# Altium project IMX8SoCIot.PrjPcb (part 4 of 4)

## Sheet Interconnect.SchDoc
size 594 x 420 mm; SheetNumber: 12; SheetTotal: 12
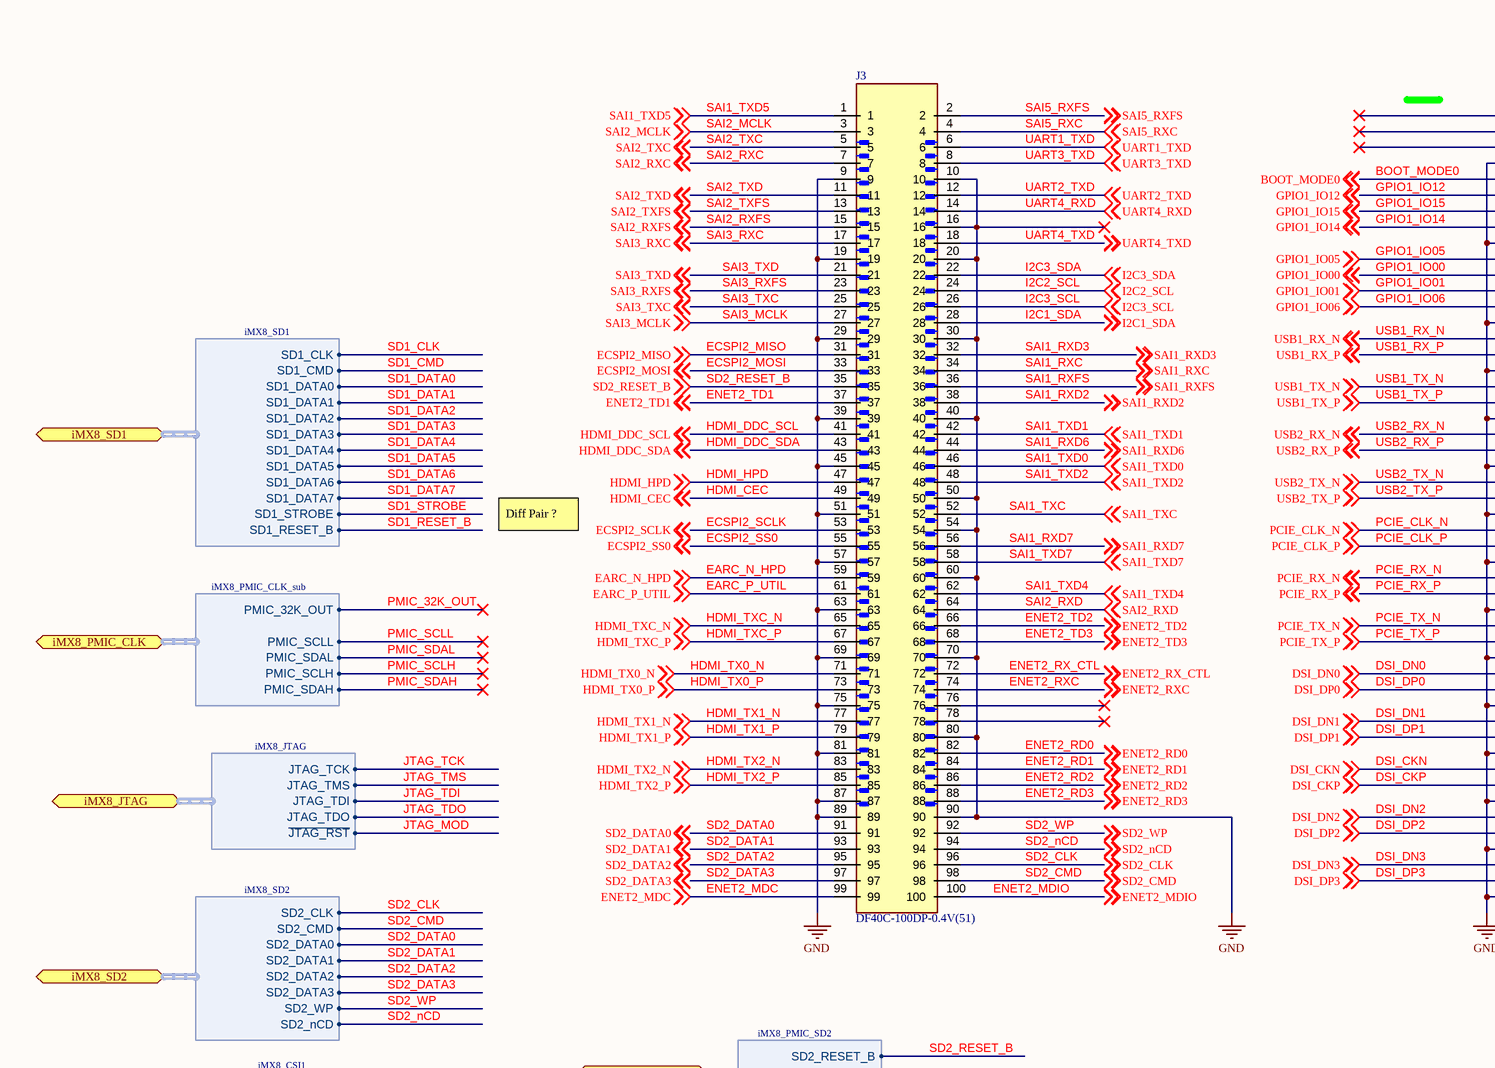
[diagram p21: Interconnect.SchDoc, top left]
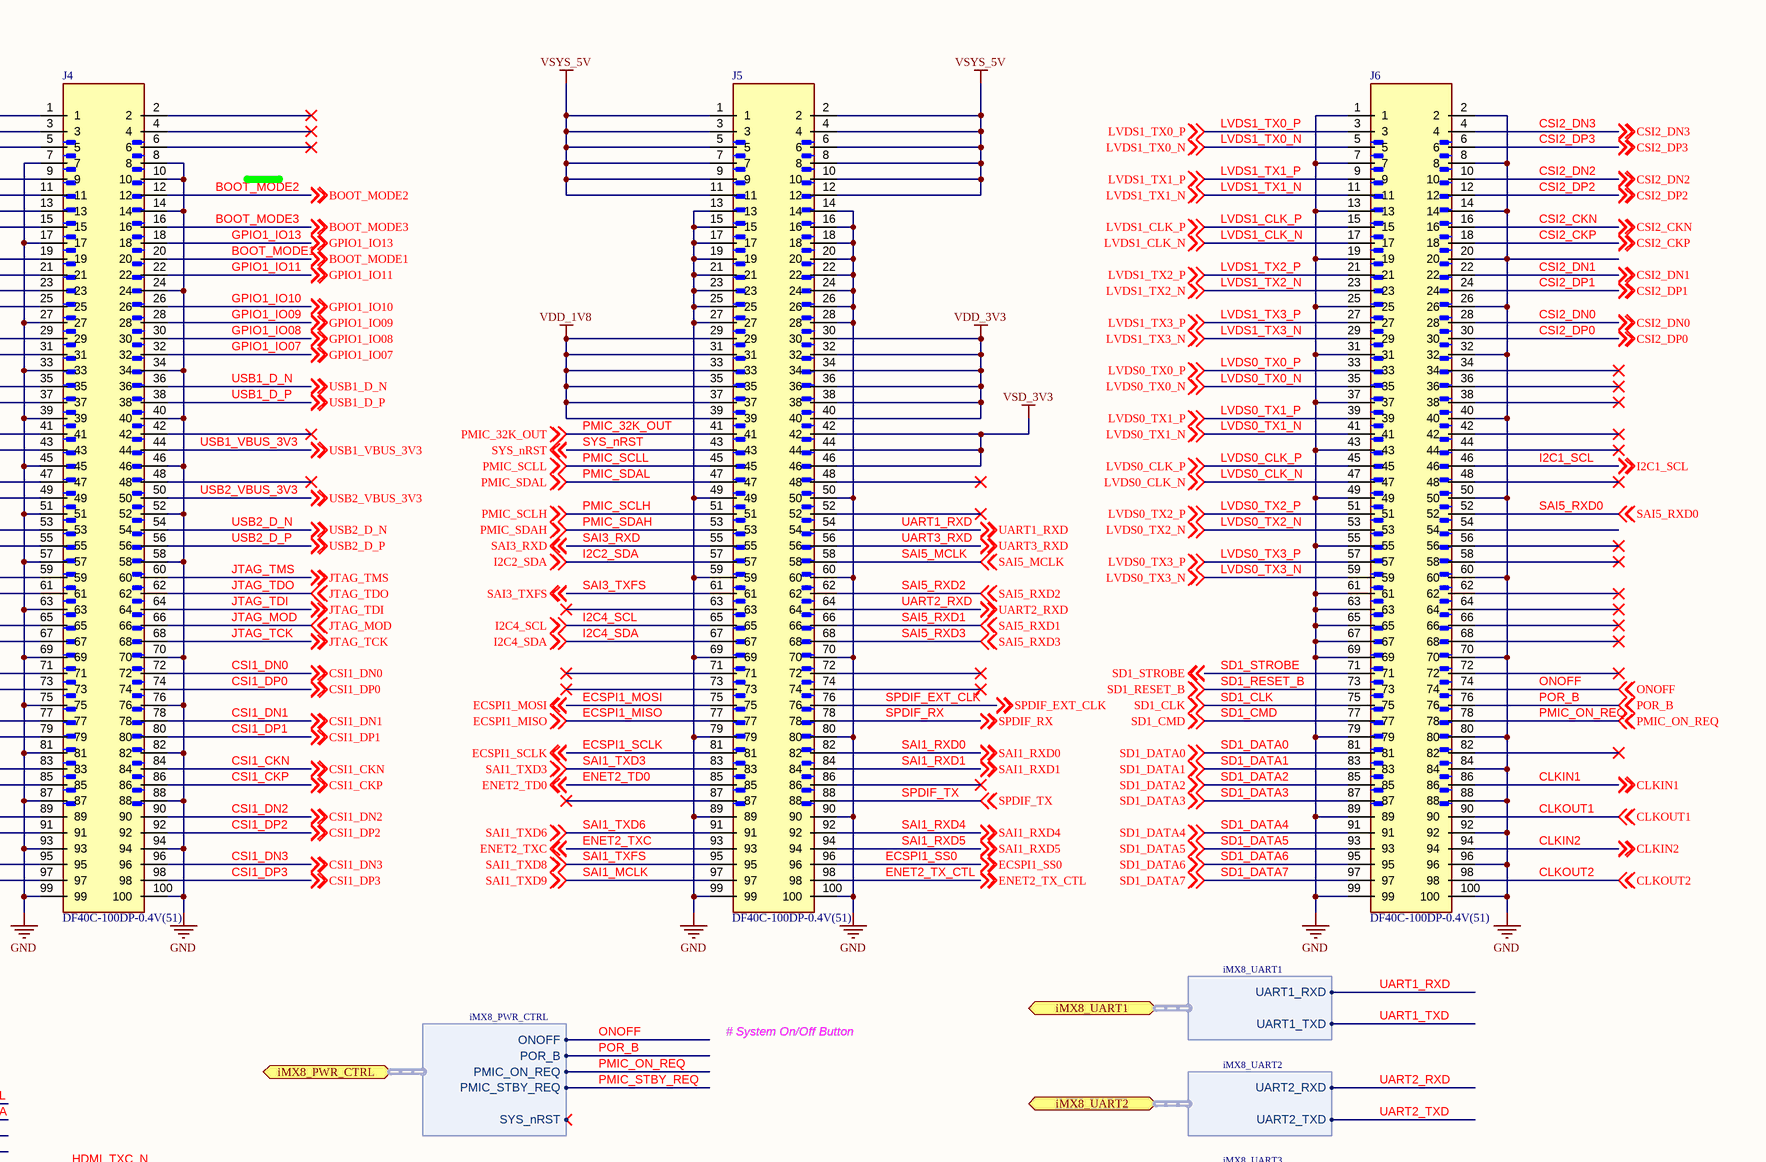
[diagram p22: Interconnect.SchDoc, top right]
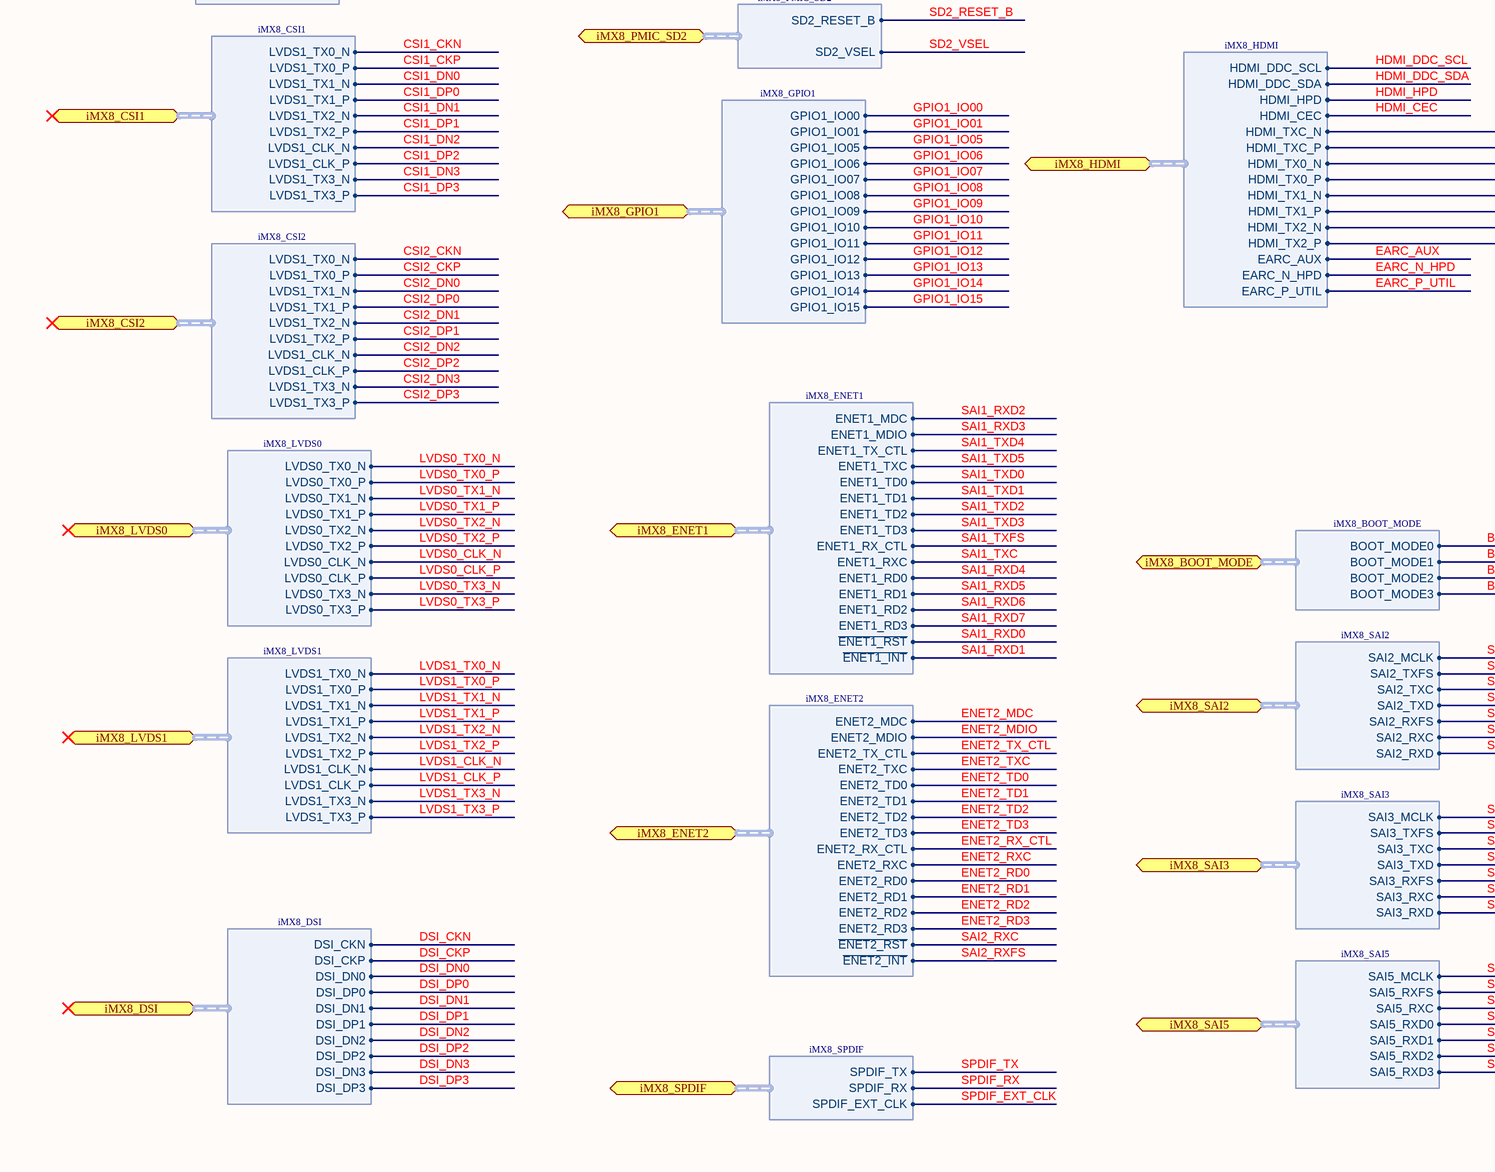
[diagram p23: Interconnect.SchDoc, bottom left]
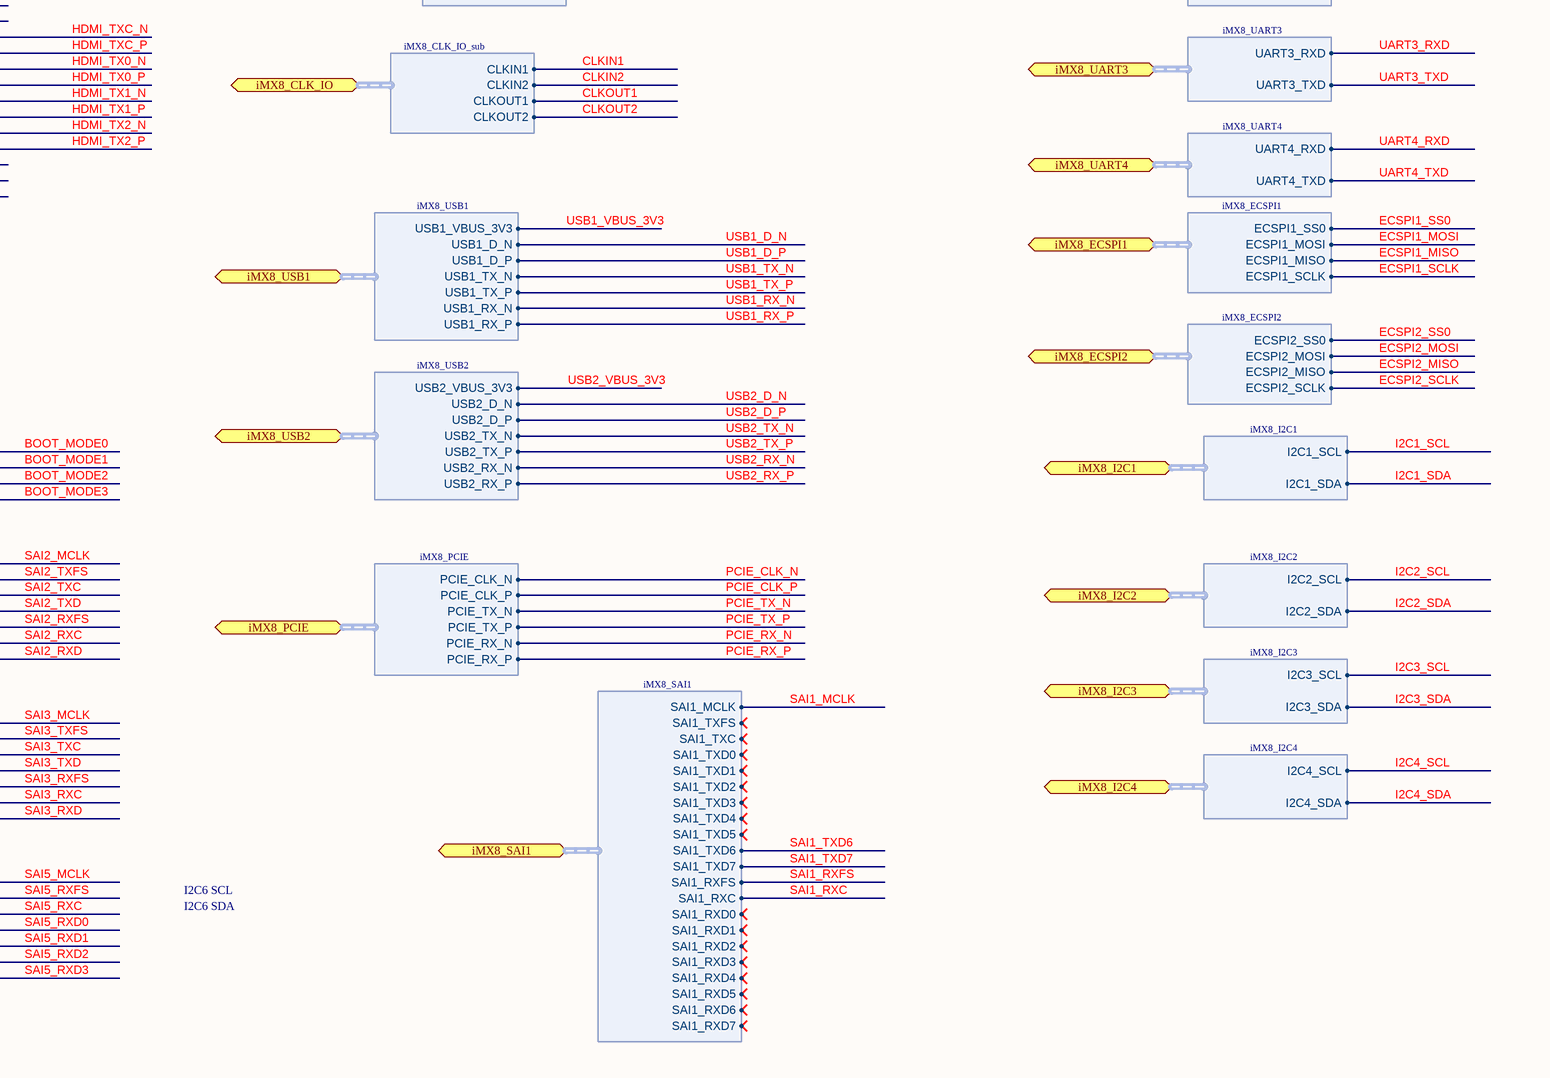
[diagram p24: Interconnect.SchDoc, bottom right]

### Parts
J3  DF40C-100DP-0.4V(51)  [HIROSE_DF40C-100DP-0.4V(51)]
J4  DF40C-100DP-0.4V(51)  [HIROSE_DF40C-100DP-0.4V(51)]
J5  DF40C-100DP-0.4V(51)  [HIROSE_DF40C-100DP-0.4V(51)]
J6  DF40C-100DP-0.4V(51)  [HIROSE_DF40C-100DP-0.4V(51)]

### Ports
iMX8_BOOT_MODE (bidir, harness iMX8_BOOT_MODE), iMX8_CLK_IO (bidir, harness iMX8_CLK_IO_sub), iMX8_CSI1 (bidir, harness iMX8_CSI1), iMX8_CSI2 (bidir, harness iMX8_CSI2), iMX8_DSI (bidir, harness iMX8_DSI), iMX8_ECSPI1 (bidir, harness iMX8_ECSPI1), iMX8_ECSPI2 (bidir, harness iMX8_ECSPI2), iMX8_ENET1 (bidir, harness iMX8_ENET1), iMX8_ENET2 (bidir, harness iMX8_ENET2), iMX8_GPIO1 (bidir, harness iMX8_GPIO1), iMX8_HDMI (bidir, harness iMX8_HDMI), iMX8_I2C1 (bidir, harness iMX8_I2C1), iMX8_I2C2 (bidir, harness iMX8_I2C2), iMX8_I2C3 (bidir, harness iMX8_I2C3), iMX8_I2C4 (bidir, harness iMX8_I2C4), iMX8_JTAG (bidir, harness iMX8_JTAG), iMX8_LVDS0 (bidir, harness iMX8_LVDS0), iMX8_LVDS1 (bidir, harness iMX8_LVDS1), iMX8_PCIE (bidir, harness iMX8_PCIE), iMX8_PMIC_CLK (bidir, harness iMX8_PMIC_CLK_sub), iMX8_PMIC_SD2 (bidir, harness iMX8_PMIC_SD2), iMX8_PWR_CTRL (bidir, harness iMX8_PWR_CTRL), iMX8_SAI1 (bidir, harness iMX8_SAI1), iMX8_SAI2 (bidir, harness iMX8_SAI2), iMX8_SAI3 (bidir, harness iMX8_SAI3), iMX8_SAI5 (bidir, harness iMX8_SAI5), iMX8_SD1 (bidir, harness iMX8_SD1), iMX8_SD2 (bidir, harness iMX8_SD2), iMX8_SPDIF (bidir, harness iMX8_SPDIF), iMX8_UART1 (bidir, harness iMX8_UART1), iMX8_UART2 (bidir, harness iMX8_UART2), iMX8_UART3 (bidir, harness iMX8_UART3), iMX8_UART4 (bidir, harness iMX8_UART4), iMX8_USB1 (bidir, harness iMX8_USB1), iMX8_USB2 (bidir, harness iMX8_USB2)

### Harnesses
iMX8_I2C1: I2C1_SCL, I2C1_SDA
iMX8_I2C2: I2C2_SCL, I2C2_SDA
iMX8_I2C3: I2C3_SCL, I2C3_SDA
iMX8_I2C4: I2C4_SCL, I2C4_SDA
iMX8_ECSPI1: ECSPI1_SS0, ECSPI1_MOSI, ECSPI1_MISO, ECSPI1_SCLK
iMX8_USB1: USB1_VBUS_3V3, USB1_D_N, USB1_D_P, USB1_TX_N, USB1_TX_P, USB1_RX_N, USB1_RX_P
iMX8_PCIE: PCIE_CLK_N, PCIE_CLK_P, PCIE_TX_N, PCIE_TX_P, PCIE_RX_N, PCIE_RX_P
iMX8_ENET1: ENET1_MDC, ENET1_MDIO, ENET1_TX_CTL, ENET1_TXC, ENET1_TD0, ENET1_TD1, ENET1_TD2, ENET1_TD3, ENET1_RX_CTL, ENET1_RXC, ENET1_RD0, ENET1_RD1, ENET1_RD2, ENET1_RD3, ~{ENET1_RST}, ~{ENET1_INT}
iMX8_ENET2: ENET2_MDC, ENET2_MDIO, ENET2_TX_CTL, ENET2_TXC, ENET2_TD0, ENET2_TD1, ENET2_TD2, ENET2_TD3, ENET2_RX_CTL, ENET2_RXC, ENET2_RD0, ENET2_RD1, ENET2_RD2, ENET2_RD3, ~{ENET2_RST}, ~{ENET2_INT}
iMX8_SPDIF: SPDIF_TX, SPDIF_RX, SPDIF_EXT_CLK
iMX8_SAI2: SAI2_MCLK, SAI2_TXFS, SAI2_TXC, SAI2_TXD, SAI2_RXFS, SAI2_RXC, SAI2_RXD
iMX8_SAI3: SAI3_MCLK, SAI3_TXFS, SAI3_TXC, SAI3_TXD, SAI3_RXFS, SAI3_RXC, SAI3_RXD
iMX8_SAI5: SAI5_MCLK, SAI5_RXFS, SAI5_RXC, SAI5_RXD0, SAI5_RXD1, SAI5_RXD2, SAI5_RXD3
iMX8_SAI1: SAI1_MCLK, SAI1_TXFS, SAI1_TXC, SAI1_TXD0, SAI1_TXD1, SAI1_TXD2, SAI1_TXD3, SAI1_TXD4, SAI1_TXD5, SAI1_TXD6, SAI1_TXD7, SAI1_RXFS, SAI1_RXC, SAI1_RXD0, SAI1_RXD1, SAI1_RXD2, SAI1_RXD3, SAI1_RXD4, SAI1_RXD5, SAI1_RXD6, SAI1_RXD7
iMX8_LVDS0: LVDS0_TX0_N, LVDS0_TX0_P, LVDS0_TX1_N, LVDS0_TX1_P, LVDS0_TX2_N, LVDS0_TX2_P, LVDS0_CLK_N, LVDS0_CLK_P, LVDS0_TX3_N, LVDS0_TX3_P
iMX8_LVDS1: LVDS1_TX0_N, LVDS1_TX0_P, LVDS1_TX1_N, LVDS1_TX1_P, LVDS1_TX2_N, LVDS1_TX2_P, LVDS1_CLK_N, LVDS1_CLK_P, LVDS1_TX3_N, LVDS1_TX3_P
iMX8_DSI: DSI_CKN, DSI_CKP, DSI_DN0, DSI_DP0, DSI_DN1, DSI_DP1, DSI_DN2, DSI_DP2, DSI_DN3, DSI_DP3
iMX8_HDMI: HDMI_DDC_SCL, HDMI_DDC_SDA, HDMI_HPD, HDMI_CEC, EARC_AUX, EARC_N_HPD, EARC_P_UTIL, HDMI_TXC_N, HDMI_TXC_P, HDMI_TX0_N, HDMI_TX0_P, HDMI_TX1_N, HDMI_TX1_P, HDMI_TX2_N, HDMI_TX2_P
iMX8_CSI1: LVDS1_TX0_N, LVDS1_TX0_P, LVDS1_TX1_N, LVDS1_TX1_P, LVDS1_TX2_N, LVDS1_TX2_P, LVDS1_CLK_N, LVDS1_CLK_P, LVDS1_TX3_N, LVDS1_TX3_P
iMX8_CSI2: LVDS1_TX0_N, LVDS1_TX0_P, LVDS1_TX1_N, LVDS1_TX1_P, LVDS1_TX2_N, LVDS1_TX2_P, LVDS1_CLK_N, LVDS1_CLK_P, LVDS1_TX3_N, LVDS1_TX3_P
iMX8_GPIO1: GPIO1_IO00, GPIO1_IO01, GPIO1_IO05, GPIO1_IO06, GPIO1_IO07, GPIO1_IO08, GPIO1_IO09, GPIO1_IO10, GPIO1_IO11, GPIO1_IO12, GPIO1_IO13, GPIO1_IO14, GPIO1_IO15
iMX8_CLK_IO_sub: CLKIN1, CLKIN2, CLKOUT1, CLKOUT2
iMX8_PWR_CTRL: ONOFF, POR_B, PMIC_ON_REQ, PMIC_STBY_REQ, SYS_nRST
iMX8_SD1: SD1_CLK, SD1_CMD, SD1_DATA0, SD1_DATA1, SD1_DATA2, SD1_DATA3, SD1_DATA4, SD1_DATA5, SD1_DATA6, SD1_DATA7, SD1_RESET_B, SD1_STROBE
iMX8_BOOT_MODE: BOOT_MODE0, BOOT_MODE1, BOOT_MODE2, BOOT_MODE3
iMX8_JTAG: JTAG_TCK, JTAG_TMS, JTAG_TDI, JTAG_TDO, ~{JTAG_RST}
iMX8_USB2: USB2_VBUS_3V3, USB2_D_N, USB2_D_P, USB2_TX_N, USB2_TX_P, USB2_RX_N, USB2_RX_P
iMX8_SD2: SD2_CLK, SD2_CMD, SD2_DATA0, SD2_DATA1, SD2_DATA2, SD2_DATA3, SD2_WP, SD2_nCD
iMX8_PMIC_SD2: SD2_RESET_B, SD2_VSEL
iMX8_ECSPI2: ECSPI2_SS0, ECSPI2_MOSI, ECSPI2_MISO, ECSPI2_SCLK
iMX8_UART1: UART1_RXD, UART1_TXD
iMX8_UART2: UART2_RXD, UART2_TXD
iMX8_UART3: UART3_RXD, UART3_TXD
iMX8_UART4: UART4_RXD, UART4_TXD
iMX8_PMIC_CLK_sub: PMIC_32K_OUT, PMIC_SCLL, PMIC_SDAL, PMIC_SCLH, PMIC_SDAH

### Nets
GND: J3.9 J3.10 J3.16 J3.19 J3.20 J3.29 J3.30 J3.39 J3.40 J3.45 J3.50 J3.51 J3.54 J3.57 J3.60 J3.63 J3.69 J3.70 J3.75 J3.80 J3.81 J3.87 J3.89 J3.90 J4.7 J4.8 J4.10 J4.14 J4.17 J4.24 J4.27 J4.33 J4.34 J4.39 J4.40 J4.45 J4.46 J4.51 J4.52 J4.57 J4.58 J4.63 J4.69 J4.70 J4.75 J4.76 J4.81 J4.82 J4.87 J4.88 J4.93 J4.94 J4.99 J4.100 J5.13 J5.14 J5.15 J5.16 J5.17 J5.18 J5.19 J5.20 J5.21 J5.22 J5.23 J5.24 J5.25 J5.26 J5.27 J5.28 J5.49 J5.50 J5.59 J5.60 J5.69 J5.70 J5.79 J5.80 J5.89 J5.90 J5.99 J5.100 J6.1 J6.2 J6.7 J6.8 J6.13 J6.14 J6.19 J6.20 J6.25 J6.26 J6.31 J6.32 J6.37 J6.40 J6.43 J6.49 J6.50 J6.55 J6.60 J6.61 J6.63 J6.65 J6.67 J6.69 J6.70 J6.79 J6.80 J6.84 J6.88 J6.89 J6.92 J6.96 J6.99 J6.100
VDD_1V8: J5.29 J5.31 J5.33 J5.35 J5.37 J5.39
VDD_3V3: J5.30 J5.32 J5.34 J5.36 J5.38 J5.40
VSD_3V3: J5.42 J5.44 J5.46
VSYS_5V: J5.1 J5.2 J5.3 J5.4 J5.5 J5.6 J5.7 J5.8 J5.9 J5.10 J5.11 J5.12
BOOT_MODE0: J4.9 ; off-sheet BOOT_MODE0, port iMX8_BOOT_MODE.BOOT_MODE0
BOOT_MODE1: J4.20 ; off-sheet BOOT_MODE1, port iMX8_BOOT_MODE.BOOT_MODE1
BOOT_MODE2: J4.12 ; off-sheet BOOT_MODE2, port iMX8_BOOT_MODE.BOOT_MODE2
BOOT_MODE3: J4.16 ; off-sheet BOOT_MODE3, port iMX8_BOOT_MODE.BOOT_MODE3
CLKIN1: J6.86 ; off-sheet CLKIN1, port iMX8_CLK_IO.CLKIN1
CLKIN2: J6.94 ; off-sheet CLKIN2, port iMX8_CLK_IO.CLKIN2
CLKOUT1: J6.90 ; off-sheet CLKOUT1, port iMX8_CLK_IO.CLKOUT1
CLKOUT2: J6.98 ; off-sheet CLKOUT2, port iMX8_CLK_IO.CLKOUT2
CSI1_CKN: J4.84 ; off-sheet CSI1_CKN, port iMX8_CSI1.LVDS1_TX0_N
CSI1_CKP: J4.86 ; off-sheet CSI1_CKP, port iMX8_CSI1.LVDS1_TX0_P
CSI1_DN0: J4.72 ; off-sheet CSI1_DN0, port iMX8_CSI1.LVDS1_TX1_N
CSI1_DN1: J4.78 ; off-sheet CSI1_DN1, port iMX8_CSI1.LVDS1_TX2_N
CSI1_DN2: J4.90 ; off-sheet CSI1_DN2, port iMX8_CSI1.LVDS1_CLK_N
CSI1_DN3: J4.96 ; off-sheet CSI1_DN3, port iMX8_CSI1.LVDS1_TX3_N
CSI1_DP0: J4.74 ; off-sheet CSI1_DP0, port iMX8_CSI1.LVDS1_TX1_P
CSI1_DP1: J4.80 ; off-sheet CSI1_DP1, port iMX8_CSI1.LVDS1_TX2_P
CSI1_DP2: J4.92 ; off-sheet CSI1_DP2, port iMX8_CSI1.LVDS1_CLK_P
CSI1_DP3: J4.98 ; off-sheet CSI1_DP3, port iMX8_CSI1.LVDS1_TX3_P
CSI2_CKN: J6.16 ; off-sheet CSI2_CKN, port iMX8_CSI2.LVDS1_TX0_N
CSI2_CKP: J6.18 ; off-sheet CSI2_CKP, port iMX8_CSI2.LVDS1_TX0_P
CSI2_DN0: J6.28 ; off-sheet CSI2_DN0, port iMX8_CSI2.LVDS1_TX1_N
CSI2_DN1: J6.22 ; off-sheet CSI2_DN1, port iMX8_CSI2.LVDS1_TX2_N
CSI2_DN2: J6.10 ; off-sheet CSI2_DN2, port iMX8_CSI2.LVDS1_CLK_N
CSI2_DN3: J6.4 ; off-sheet CSI2_DN3, port iMX8_CSI2.LVDS1_TX3_N
CSI2_DP0: J6.30 ; off-sheet CSI2_DP0, port iMX8_CSI2.LVDS1_TX1_P
CSI2_DP1: J6.24 ; off-sheet CSI2_DP1, port iMX8_CSI2.LVDS1_TX2_P
CSI2_DP2: J6.12 ; off-sheet CSI2_DP2, port iMX8_CSI2.LVDS1_CLK_P
CSI2_DP3: J6.6 ; off-sheet CSI2_DP3, port iMX8_CSI2.LVDS1_TX3_P
DSI_CKN: J4.83 ; off-sheet DSI_CKN, port iMX8_DSI.DSI_CKN
DSI_CKP: J4.85 ; off-sheet DSI_CKP, port iMX8_DSI.DSI_CKP
DSI_DN0: J4.71 ; off-sheet DSI_DN0, port iMX8_DSI.DSI_DN0
DSI_DN1: J4.77 ; off-sheet DSI_DN1, port iMX8_DSI.DSI_DN1
DSI_DN2: J4.89 ; off-sheet DSI_DN2, port iMX8_DSI.DSI_DN2
DSI_DN3: J4.95 ; off-sheet DSI_DN3, port iMX8_DSI.DSI_DN3
DSI_DP0: J4.73 ; off-sheet DSI_DP0, port iMX8_DSI.DSI_DP0
DSI_DP1: J4.79 ; off-sheet DSI_DP1, port iMX8_DSI.DSI_DP1
DSI_DP2: J4.91 ; off-sheet DSI_DP2, port iMX8_DSI.DSI_DP2
DSI_DP3: J4.97 ; off-sheet DSI_DP3, port iMX8_DSI.DSI_DP3
EARC_N_HPD: J3.59 ; off-sheet EARC_N_HPD, port iMX8_HDMI.EARC_N_HPD
EARC_P_UTIL: J3.61 ; off-sheet EARC_P_UTIL, port iMX8_HDMI.EARC_P_UTIL
ECSPI1_MISO: J5.77 ; off-sheet ECSPI1_MISO, port iMX8_ECSPI1.ECSPI1_MISO
ECSPI1_MOSI: J5.75 ; off-sheet ECSPI1_MOSI, port iMX8_ECSPI1.ECSPI1_MOSI
ECSPI1_SCLK: J5.81 ; off-sheet ECSPI1_SCLK, port iMX8_ECSPI1.ECSPI1_SCLK  [project net ~{mPCIe_RST}]
ECSPI1_SS0: J5.96 ; off-sheet ECSPI1_SS0, port iMX8_ECSPI1.ECSPI1_SS0  [project net ~{USB_HUB_RST}]
ECSPI2_MISO: J3.31 ; off-sheet ECSPI2_MISO, port iMX8_ECSPI2.ECSPI2_MISO
ECSPI2_MOSI: J3.33 ; off-sheet ECSPI2_MOSI, port iMX8_ECSPI2.ECSPI2_MOSI
ECSPI2_SCLK: J3.53 ; off-sheet ECSPI2_SCLK, port iMX8_ECSPI2.ECSPI2_SCLK
ECSPI2_SS0: J3.55 ; off-sheet ECSPI2_SS0, port iMX8_ECSPI2.ECSPI2_SS0
ENET2_MDC: J3.99 ; off-sheet ENET2_MDC, port iMX8_ENET2.ENET2_MDC
ENET2_MDIO: J3.100 ; off-sheet ENET2_MDIO, port iMX8_ENET2.ENET2_MDIO
ENET2_RD0: J3.82 ; off-sheet ENET2_RD0, port iMX8_ENET2.ENET2_RD0
ENET2_RD1: J3.84 ; off-sheet ENET2_RD1, port iMX8_ENET2.ENET2_RD1
ENET2_RD2: J3.86 ; off-sheet ENET2_RD2, port iMX8_ENET2.ENET2_RD2
ENET2_RD3: J3.88 ; off-sheet ENET2_RD3, port iMX8_ENET2.ENET2_RD3
ENET2_RX_CTL: J3.72 ; off-sheet ENET2_RX_CTL, port iMX8_ENET2.ENET2_RX_CTL
ENET2_RXC: J3.74 ; off-sheet ENET2_RXC, port iMX8_ENET2.ENET2_RXC
ENET2_TD0: J5.85 ; off-sheet ENET2_TD0, port iMX8_ENET2.ENET2_TD0
ENET2_TD1: J3.37 ; off-sheet ENET2_TD1, port iMX8_ENET2.ENET2_TD1
ENET2_TD2: J3.66 ; off-sheet ENET2_TD2, port iMX8_ENET2.ENET2_TD2
ENET2_TD3: J3.68 ; off-sheet ENET2_TD3, port iMX8_ENET2.ENET2_TD3
ENET2_TX_CTL: J5.98 ; off-sheet ENET2_TX_CTL, port iMX8_ENET2.ENET2_TX_CTL
ENET2_TXC: J5.93 ; off-sheet ENET2_TXC, port iMX8_ENET2.ENET2_TXC
GPIO1_IO00: J4.21 ; off-sheet GPIO1_IO00, port iMX8_GPIO1.GPIO1_IO00
GPIO1_IO01: J4.23 ; off-sheet GPIO1_IO01, port iMX8_GPIO1.GPIO1_IO01
GPIO1_IO05: J4.19 ; off-sheet GPIO1_IO05, port iMX8_GPIO1.GPIO1_IO05
GPIO1_IO06: J4.25 ; off-sheet GPIO1_IO06, port iMX8_GPIO1.GPIO1_IO06
GPIO1_IO07: J4.32 ; off-sheet GPIO1_IO07, port iMX8_GPIO1.GPIO1_IO07
GPIO1_IO08: J4.30 ; off-sheet GPIO1_IO08, port iMX8_GPIO1.GPIO1_IO08
GPIO1_IO09: J4.28 ; off-sheet GPIO1_IO09, port iMX8_GPIO1.GPIO1_IO09
GPIO1_IO10: J4.26 ; off-sheet GPIO1_IO10, port iMX8_GPIO1.GPIO1_IO10
GPIO1_IO11: J4.22 ; off-sheet GPIO1_IO11, port iMX8_GPIO1.GPIO1_IO11
GPIO1_IO12: J4.11 ; off-sheet GPIO1_IO12, port iMX8_GPIO1.GPIO1_IO12
GPIO1_IO13: J4.18 ; off-sheet GPIO1_IO13, port iMX8_GPIO1.GPIO1_IO13
GPIO1_IO14: J4.15 ; off-sheet GPIO1_IO14, port iMX8_GPIO1.GPIO1_IO14
GPIO1_IO15: J4.13 ; off-sheet GPIO1_IO15, port iMX8_GPIO1.GPIO1_IO15
HDMI_CEC: J3.49 ; off-sheet HDMI_CEC, port iMX8_HDMI.HDMI_CEC
HDMI_DDC_SCL: J3.41 ; off-sheet HDMI_DDC_SCL, port iMX8_HDMI.HDMI_DDC_SCL
HDMI_DDC_SDA: J3.43 ; off-sheet HDMI_DDC_SDA, port iMX8_HDMI.HDMI_DDC_SDA
HDMI_HPD: J3.47 ; off-sheet HDMI_HPD, port iMX8_HDMI.HDMI_HPD
HDMI_TX0_N: J3.71 ; off-sheet HDMI_TX0_N, port iMX8_HDMI.HDMI_TX0_N
HDMI_TX0_P: J3.73 ; off-sheet HDMI_TX0_P, port iMX8_HDMI.HDMI_TX0_P
HDMI_TX1_N: J3.77 ; off-sheet HDMI_TX1_N, port iMX8_HDMI.HDMI_TX1_N
HDMI_TX1_P: J3.79 ; off-sheet HDMI_TX1_P, port iMX8_HDMI.HDMI_TX1_P
HDMI_TX2_N: J3.83 ; off-sheet HDMI_TX2_N, port iMX8_HDMI.HDMI_TX2_N
HDMI_TX2_P: J3.85 ; off-sheet HDMI_TX2_P, port iMX8_HDMI.HDMI_TX2_P
HDMI_TXC_N: J3.65 ; off-sheet HDMI_TXC_N, port iMX8_HDMI.HDMI_TXC_N
HDMI_TXC_P: J3.67 ; off-sheet HDMI_TXC_P, port iMX8_HDMI.HDMI_TXC_P
I2C1_SCL: J6.46 ; off-sheet I2C1_SCL, port iMX8_I2C1.I2C1_SCL
I2C1_SDA: J3.28 ; off-sheet I2C1_SDA, port iMX8_I2C1.I2C1_SDA
I2C2_SCL: J3.24 ; off-sheet I2C2_SCL, port iMX8_I2C2.I2C2_SCL
I2C2_SDA: J5.57 ; off-sheet I2C2_SDA, port iMX8_I2C2.I2C2_SDA
I2C3_SCL: J3.26 ; off-sheet I2C3_SCL, port iMX8_I2C3.I2C3_SCL
I2C3_SDA: J3.22 ; off-sheet I2C3_SDA, port iMX8_I2C3.I2C3_SDA
I2C4_SCL: J5.65 ; off-sheet I2C4_SCL, port iMX8_I2C4.I2C4_SCL
I2C4_SDA: J5.67 ; off-sheet I2C4_SDA, port iMX8_I2C4.I2C4_SDA
JTAG_MOD: J4.66 ; off-sheet JTAG_MOD, port iMX8_JTAG.~{JTAG_RST}  [project net ~{JTAG_RST}]
JTAG_TCK: J4.68 ; off-sheet JTAG_TCK, port iMX8_JTAG.JTAG_TCK
JTAG_TDI: J4.64 ; off-sheet JTAG_TDI, port iMX8_JTAG.JTAG_TDI
JTAG_TDO: J4.62 ; off-sheet JTAG_TDO, port iMX8_JTAG.JTAG_TDO
JTAG_TMS: J4.60 ; off-sheet JTAG_TMS, port iMX8_JTAG.JTAG_TMS
LVDS0_CLK_N: J6.47 ; off-sheet LVDS0_CLK_N, port iMX8_LVDS0.LVDS0_CLK_N
LVDS0_CLK_P: J6.45 ; off-sheet LVDS0_CLK_P, port iMX8_LVDS0.LVDS0_CLK_P
LVDS0_TX0_N: J6.35 ; off-sheet LVDS0_TX0_N, port iMX8_LVDS0.LVDS0_TX0_N
LVDS0_TX0_P: J6.33 ; off-sheet LVDS0_TX0_P, port iMX8_LVDS0.LVDS0_TX0_P
LVDS0_TX1_N: J6.41 ; off-sheet LVDS0_TX1_N, port iMX8_LVDS0.LVDS0_TX1_N
LVDS0_TX1_P: J6.39 ; off-sheet LVDS0_TX1_P, port iMX8_LVDS0.LVDS0_TX1_P
LVDS0_TX2_N: J6.53 ; off-sheet LVDS0_TX2_N, port iMX8_LVDS0.LVDS0_TX2_N
LVDS0_TX2_P: J6.51 ; off-sheet LVDS0_TX2_P, port iMX8_LVDS0.LVDS0_TX2_P
LVDS0_TX3_N: J6.59 ; off-sheet LVDS0_TX3_N, port iMX8_LVDS0.LVDS0_TX3_N
LVDS0_TX3_P: J6.57 ; off-sheet LVDS0_TX3_P, port iMX8_LVDS0.LVDS0_TX3_P
LVDS1_CLK_N: J6.17 ; off-sheet LVDS1_CLK_N, port iMX8_LVDS1.LVDS1_CLK_N
LVDS1_CLK_P: J6.15 ; off-sheet LVDS1_CLK_P, port iMX8_LVDS1.LVDS1_CLK_P
LVDS1_TX0_N: J6.5 ; off-sheet LVDS1_TX0_N, port iMX8_LVDS1.LVDS1_TX0_N
LVDS1_TX0_P: J6.3 ; off-sheet LVDS1_TX0_P, port iMX8_LVDS1.LVDS1_TX0_P
LVDS1_TX1_N: J6.11 ; off-sheet LVDS1_TX1_N, port iMX8_LVDS1.LVDS1_TX1_N
LVDS1_TX1_P: J6.9 ; off-sheet LVDS1_TX1_P, port iMX8_LVDS1.LVDS1_TX1_P
LVDS1_TX2_N: J6.23 ; off-sheet LVDS1_TX2_N, port iMX8_LVDS1.LVDS1_TX2_N
LVDS1_TX2_P: J6.21 ; off-sheet LVDS1_TX2_P, port iMX8_LVDS1.LVDS1_TX2_P
LVDS1_TX3_N: J6.29 ; off-sheet LVDS1_TX3_N, port iMX8_LVDS1.LVDS1_TX3_N
LVDS1_TX3_P: J6.27 ; off-sheet LVDS1_TX3_P, port iMX8_LVDS1.LVDS1_TX3_P
ONOFF: J6.74 ; off-sheet ONOFF, port iMX8_PWR_CTRL.ONOFF
PCIE_CLK_N: J4.53 ; off-sheet PCIE_CLK_N, port iMX8_PCIE.PCIE_CLK_N
PCIE_CLK_P: J4.55 ; off-sheet PCIE_CLK_P, port iMX8_PCIE.PCIE_CLK_P
PCIE_RX_N: J4.59 ; off-sheet PCIE_RX_N, port iMX8_PCIE.PCIE_RX_N
PCIE_RX_P: J4.61 ; off-sheet PCIE_RX_P, port iMX8_PCIE.PCIE_RX_P
PCIE_TX_N: J4.65 ; off-sheet PCIE_TX_N, port iMX8_PCIE.PCIE_TX_N
PCIE_TX_P: J4.67 ; off-sheet PCIE_TX_P, port iMX8_PCIE.PCIE_TX_P
PMIC_32K_OUT: J5.41 ; off-sheet PMIC_32K_OUT, port iMX8_PMIC_CLK.PMIC_32K_OUT
PMIC_ON_REQ: J6.78 ; off-sheet PMIC_ON_REQ, port iMX8_PWR_CTRL.PMIC_ON_REQ
PMIC_SCLH: J5.51 ; off-sheet PMIC_SCLH, port iMX8_PMIC_CLK.PMIC_SCLH
PMIC_SCLL: J5.45 ; off-sheet PMIC_SCLL, port iMX8_PMIC_CLK.PMIC_SCLL
PMIC_SDAH: J5.53 ; off-sheet PMIC_SDAH, port iMX8_PMIC_CLK.PMIC_SDAH
PMIC_SDAL: J5.47 ; off-sheet PMIC_SDAL, port iMX8_PMIC_CLK.PMIC_SDAL
POR_B: J6.76 ; off-sheet POR_B, port iMX8_PWR_CTRL.POR_B
SAI1_MCLK: J5.97 ; off-sheet SAI1_TXD9, port iMX8_SAI1.SAI1_MCLK  [also labelled SAI1_TXD9]
SAI1_RXC: J3.34 ; off-sheet SAI1_RXC, port iMX8_SAI1.SAI1_RXC
SAI1_RXD0: J5.82 ; off-sheet SAI1_RXD0, port iMX8_ENET1.~{ENET1_RST}
SAI1_RXD1: J5.84 ; off-sheet SAI1_RXD1, port iMX8_ENET1.~{ENET1_INT}
SAI1_RXD2: J3.38 ; off-sheet SAI1_RXD2, port iMX8_ENET1.ENET1_MDC
SAI1_RXD3: J3.32 ; off-sheet SAI1_RXD3, port iMX8_ENET1.ENET1_MDIO
SAI1_RXD4: J5.92 ; off-sheet SAI1_RXD4, port iMX8_ENET1.ENET1_RD0
SAI1_RXD5: J5.94 ; off-sheet SAI1_RXD5, port iMX8_ENET1.ENET1_RD1
SAI1_RXD6: J3.44 ; off-sheet SAI1_RXD6, port iMX8_ENET1.ENET1_RD2
SAI1_RXD7: J3.56 ; off-sheet SAI1_RXD7, port iMX8_ENET1.ENET1_RD3
SAI1_RXFS: J3.36 ; off-sheet SAI1_RXFS, port iMX8_SAI1.SAI1_RXFS
SAI1_TXC: J3.52 ; off-sheet SAI1_TXC, port iMX8_ENET1.ENET1_RXC
SAI1_TXD0: J3.46 ; off-sheet SAI1_TXD0, port iMX8_ENET1.ENET1_TD0
SAI1_TXD1: J3.42 ; off-sheet SAI1_TXD1, port iMX8_ENET1.ENET1_TD1
SAI1_TXD2: J3.48 ; off-sheet SAI1_TXD2, port iMX8_ENET1.ENET1_TD2
SAI1_TXD3: J5.83 ; off-sheet SAI1_TXD3, port iMX8_ENET1.ENET1_TD3
SAI1_TXD4: J3.62 ; off-sheet SAI1_TXD4, port iMX8_ENET1.ENET1_TX_CTL
SAI1_TXD5: J3.1 ; off-sheet SAI1_TXD5, port iMX8_ENET1.ENET1_TXC
SAI1_TXD6: J5.91 ; off-sheet SAI1_TXD6, port iMX8_SAI1.SAI1_TXD6
SAI1_TXD7: J3.58 ; off-sheet SAI1_TXD7, port iMX8_SAI1.SAI1_TXD7
SAI1_TXFS: J5.95 ; off-sheet SAI1_TXD8, port iMX8_ENET1.ENET1_RX_CTL  [also labelled SAI1_TXD8]
SAI2_MCLK: J3.3 ; off-sheet SAI2_MCLK, port iMX8_SAI2.SAI2_MCLK
SAI2_RXC: J3.7 ; off-sheet SAI2_RXC, port iMX8_ENET2.~{ENET2_RST}, port iMX8_SAI2.SAI2_RXC
SAI2_RXD: J3.64 ; off-sheet SAI2_RXD, port iMX8_SAI2.SAI2_RXD
SAI2_RXFS: J3.15 ; off-sheet SAI2_RXFS, port iMX8_ENET2.~{ENET2_INT}, port iMX8_SAI2.SAI2_RXFS
SAI2_TXC: J3.5 ; off-sheet SAI2_TXC, port iMX8_SAI2.SAI2_TXC
SAI2_TXD: J3.11 ; off-sheet SAI2_TXD, port iMX8_SAI2.SAI2_TXD
SAI2_TXFS: J3.13 ; off-sheet SAI2_TXFS, port iMX8_SAI2.SAI2_TXFS
SAI3_MCLK: J3.27 ; off-sheet SAI3_MCLK, port iMX8_SAI3.SAI3_MCLK
SAI3_RXC: J3.17 ; off-sheet SAI3_RXC, port iMX8_SAI3.SAI3_RXC
SAI3_RXD: J5.55 ; off-sheet SAI3_RXD, port iMX8_SAI3.SAI3_RXD
SAI3_RXFS: J3.23 ; off-sheet SAI3_RXFS, port iMX8_SAI3.SAI3_RXFS
SAI3_TXC: J3.25 ; off-sheet SAI3_TXC, port iMX8_SAI3.SAI3_TXC
SAI3_TXD: J3.21 ; off-sheet SAI3_TXD, port iMX8_SAI3.SAI3_TXD
SAI3_TXFS: J5.61 ; off-sheet SAI3_TXFS, port iMX8_SAI3.SAI3_TXFS
SAI5_MCLK: J5.58 ; off-sheet SAI5_MCLK, port iMX8_SAI5.SAI5_MCLK
SAI5_RXC: J3.4 ; off-sheet SAI5_RXC, port iMX8_SAI5.SAI5_RXC  [project net I2C6_SDA]
SAI5_RXD0: J6.52 ; off-sheet SAI5_RXD0, port iMX8_SAI5.SAI5_RXD0
SAI5_RXD1: J5.66 ; off-sheet SAI5_RXD1, port iMX8_SAI5.SAI5_RXD1
SAI5_RXD2: J5.62 ; off-sheet SAI5_RXD2, port iMX8_SAI5.SAI5_RXD2
SAI5_RXD3: J5.68 ; off-sheet SAI5_RXD3, port iMX8_SAI5.SAI5_RXD3
SAI5_RXFS: J3.2 ; off-sheet SAI5_RXFS, port iMX8_SAI5.SAI5_RXFS  [project net I2C6_SCL]
SD1_CLK: J6.75 ; off-sheet SD1_CLK, port iMX8_SD1.SD1_CLK
SD1_CMD: J6.77 ; off-sheet SD1_CMD, port iMX8_SD1.SD1_CMD
SD1_DATA0: J6.81 ; off-sheet SD1_DATA0, port iMX8_SD1.SD1_DATA0
SD1_DATA1: J6.83 ; off-sheet SD1_DATA1, port iMX8_SD1.SD1_DATA1
SD1_DATA2: J6.85 ; off-sheet SD1_DATA2, port iMX8_SD1.SD1_DATA2
SD1_DATA3: J6.87 ; off-sheet SD1_DATA3, port iMX8_SD1.SD1_DATA3
SD1_DATA4: J6.91 ; off-sheet SD1_DATA4, port iMX8_SD1.SD1_DATA4
SD1_DATA5: J6.93 ; off-sheet SD1_DATA5, port iMX8_SD1.SD1_DATA5
SD1_DATA6: J6.95 ; off-sheet SD1_DATA6, port iMX8_SD1.SD1_DATA6
SD1_DATA7: J6.97 ; off-sheet SD1_DATA7, port iMX8_SD1.SD1_DATA7
SD1_RESET_B: J6.73 ; off-sheet SD1_RESET_B, port iMX8_SD1.SD1_RESET_B
SD1_STROBE: J6.71 ; off-sheet SD1_STROBE, port iMX8_SD1.SD1_STROBE
SD2_CLK: J3.96 ; off-sheet SD2_CLK, port iMX8_SD2.SD2_CLK
SD2_CMD: J3.98 ; off-sheet SD2_CMD, port iMX8_SD2.SD2_CMD
SD2_DATA0: J3.91 ; off-sheet SD2_DATA0, port iMX8_SD2.SD2_DATA0
SD2_DATA1: J3.93 ; off-sheet SD2_DATA1, port iMX8_SD2.SD2_DATA1
SD2_DATA2: J3.95 ; off-sheet SD2_DATA2, port iMX8_SD2.SD2_DATA2
SD2_DATA3: J3.97 ; off-sheet SD2_DATA3, port iMX8_SD2.SD2_DATA3
SD2_nCD: J3.94 ; off-sheet SD2_nCD, port iMX8_SD2.SD2_nCD
SD2_RESET_B: J3.35 ; off-sheet SD2_RESET_B, port iMX8_PMIC_SD2.SD2_RESET_B
SD2_WP: J3.92 ; off-sheet SD2_WP, port iMX8_SD2.SD2_WP
SPDIF_EXT_CLK: J5.76 ; off-sheet SPDIF_EXT_CLK, port iMX8_SPDIF.SPDIF_EXT_CLK  [project net I2C5_SDA]
SPDIF_RX: J5.78 ; off-sheet SPDIF_RX, port iMX8_SPDIF.SPDIF_RX
SPDIF_TX: J5.88 ; off-sheet SPDIF_TX, port iMX8_SPDIF.SPDIF_TX  [project net I2C5_SCL]
SYS_nRST: J5.43 ; off-sheet SYS_nRST, port iMX8_PWR_CTRL.SYS_nRST
UART1_RXD: J5.54 ; off-sheet UART1_RXD, port iMX8_UART1.UART1_RXD
UART1_TXD: J3.6 ; off-sheet UART1_TXD, port iMX8_UART1.UART1_TXD
UART2_RXD: J5.64 ; off-sheet UART2_RXD, port iMX8_UART2.UART2_RXD
UART2_TXD: J3.12 ; off-sheet UART2_TXD, port iMX8_UART2.UART2_TXD
UART3_RXD: J5.56 ; off-sheet UART3_RXD, port iMX8_UART3.UART3_RXD
UART3_TXD: J3.8 ; off-sheet UART3_TXD, port iMX8_UART3.UART3_TXD
UART4_RXD: J3.14 ; off-sheet UART4_RXD, port iMX8_UART4.UART4_RXD
UART4_TXD: J3.18 ; off-sheet UART4_TXD, port iMX8_UART4.UART4_TXD
USB1_D_N: J4.36 ; off-sheet USB1_D_N, port iMX8_USB1.USB1_D_N
USB1_D_P: J4.38 ; off-sheet USB1_D_P, port iMX8_USB1.USB1_D_P
USB1_RX_N: J4.29 ; off-sheet USB1_RX_N, port iMX8_USB1.USB1_RX_N
USB1_RX_P: J4.31 ; off-sheet USB1_RX_P, port iMX8_USB1.USB1_RX_P
USB1_TX_N: J4.35 ; off-sheet USB1_TX_N, port iMX8_USB1.USB1_TX_N
USB1_TX_P: J4.37 ; off-sheet USB1_TX_P, port iMX8_USB1.USB1_TX_P
USB1_VBUS_3V3: J4.44 ; off-sheet USB1_VBUS_3V3, port iMX8_USB1.USB1_VBUS_3V3
USB2_D_N: J4.54 ; off-sheet USB2_D_N, port iMX8_USB2.USB2_D_N
USB2_D_P: J4.56 ; off-sheet USB2_D_P, port iMX8_USB2.USB2_D_P
USB2_RX_N: J4.41 ; off-sheet USB2_RX_N, port iMX8_USB2.USB2_RX_N
USB2_RX_P: J4.43 ; off-sheet USB2_RX_P, port iMX8_USB2.USB2_RX_P
USB2_TX_N: J4.47 ; off-sheet USB2_TX_N, port iMX8_USB2.USB2_TX_N
USB2_TX_P: J4.49 ; off-sheet USB2_TX_P, port iMX8_USB2.USB2_TX_P
USB2_VBUS_3V3: J4.50 ; off-sheet USB2_VBUS_3V3, port iMX8_USB2.USB2_VBUS_3V3

Not connected (* = marked no-connect by the designer): J3 76* 78*; J4 1* 2* 3* 4* 5* 6* 42* 48*; J5 48* 52* 63* 71* 72* 73* 74* 86* 87*; J6 34* 36* 38* 42* 44* 48* 54 56* 58* 62* 64* 66* 68* 72* 82*

### Notes on the sheet
- Diff Pair ?
- # System On/Off Button
- I2C6 SDA
- I2C6 SCL
- DWG NO:
- REV:
- THIS DOCUMENT AND THE DATA DISCLOSED HEREIN OR
- HEREWITH IS THE PROPERTY OF ALTIUM LIMITED AND MAY
- BE FREELY DISTRIBUTED IN WHOLE. NO RIGHTS ARE
- RESERVED OR EXPRESS OR IMPLIED WARANTEE GIVEN.
- REVISION
- DESCRIPTION
- DATE
- APPROVED
- ENG:
- APPROVALS
- PROJECT
- DSN:
- CHK:
- REFERENCE DOCUMENTS
- PROJECT REVISION:
- TITLE
- DOCUMENT REVISION:
- DESIGN ITEM:
- BOM:
- FAB DWG:
- PCB DWG:
- ASSY DWG:
- SCALE:
- A2
- SIZE
- CAGE CODE
- FILE NAME
- DWG NO.
- SHEET
- OF
- REV

### Library data of the parts
J3-J6 = DF40C-100DP-0.4V(51): 100 Position Connector Plug, Outer Shroud Contacts Surface Mount Gold; MF: Hirose Electric; SnapEDA_Link: https://www.snapeda.com/parts/DF40C-100DP-0.4V(51)/Hirose/view-part/?ref=snap; Package: None; Value: *; MP: DF40C-100DP-0.4V(51); Check_prices: https://www.snapeda.com/parts/DF40C-100DP-0.4V(51)/Hirose/view-part/?ref=eda

## Nets that join several sheets
GND: IMX8_DISPLAY (C87.1 R21.2), IMX8_eMMC (26 pins), IMX8_IO (8 pins), IMX8_LPDDR4 (86 pins), IMX8_PHY (R18.1 R19.1 R20.1), IMX8_PMIC (36 pins), IMX8_PWR (176 pins), Interconnect (116 pins)
NVCC_DRAM_1V1: IMX8_LPDDR4 (64 pins), IMX8_PMIC (5 pins), IMX8_PWR (18 pins)
NVCC_SD2: IMX8_PMIC (C115.2 PTP26.1 U5.55), IMX8_PWR (C15.2 U1.W24)
NVCC_SNVS_1V8: IMX8_IO (R1.1 R2.1 R3.1), IMX8_PMIC (C103.1 PTP18.1 R30.1 U5.3), IMX8_PWR (C5.2 U1.R24)
VDD_1V8: IMX8_eMMC (17 pins), IMX8_LPDDR4 (14 pins), IMX8_PMIC (6 pins), IMX8_PWR (14 pins), Interconnect (6 pins)
VDD_3V3: IMX8_INTERFACE (12 pins), IMX8_eMMC (7 pins), IMX8_PMIC (7 pins), IMX8_PWR (14 pins), Interconnect (6 pins)
VDD_ARM: IMX8_PMIC (6 pins), IMX8_PWR (26 pins)
VDD_SOC: IMX8_PMIC (9 pins), IMX8_PWR (63 pins)
VDDA_1V8: IMX8_PMIC (C110.1 PTP22.1 U5.54), IMX8_PWR (24 pins)
VSD_3V3: IMX8_PMIC (C129.1 PTP33.1 U5.23), Interconnect (J5.42 J5.44 J5.46)
VSYS_5V: IMX8_PMIC (22 pins), Interconnect (12 pins)
~{JTAG_RST}: IMX8_IO (PTP1.1 R4.1 U1.G20), Interconnect (J4.66)
~{mPCIe_RST}: IMX8_IO (U1.AF20), Interconnect (J5.81)
~{USB_HUB_RST}: IMX8_IO (U1.AE20), Interconnect (J5.96)
BOOT_MODE0: IMX8_IO (U1.G10), Interconnect (J4.9)
BOOT_MODE1: IMX8_IO (U1.F8), Interconnect (J4.20)
BOOT_MODE2: IMX8_IO (U1.G8), Interconnect (J4.12)
BOOT_MODE3: IMX8_IO (U1.G12), Interconnect (J4.16)
CLKIN1: IMX8_IO (U1.K28), Interconnect (J6.86)
CLKIN2: IMX8_IO (U1.L28), Interconnect (J6.94)
CLKOUT1: IMX8_IO (U1.K29), Interconnect (J6.90)
CLKOUT2: IMX8_IO (U1.L29), Interconnect (J6.98)
CSI1_CKN: IMX8_INPUT (U1.E22), Interconnect (J4.84)
CSI1_CKP: IMX8_INPUT (U1.D22), Interconnect (J4.86)
CSI1_DN0: IMX8_INPUT (U1.E18), Interconnect (J4.72)
CSI1_DN1: IMX8_INPUT (U1.E20), Interconnect (J4.78)
CSI1_DN2: IMX8_INPUT (U1.E24), Interconnect (J4.90)
CSI1_DN3: IMX8_INPUT (U1.E26), Interconnect (J4.96)
CSI1_DP0: IMX8_INPUT (U1.D18), Interconnect (J4.74)
CSI1_DP1: IMX8_INPUT (U1.D20), Interconnect (J4.80)
CSI1_DP2: IMX8_INPUT (U1.D24), Interconnect (J4.92)
CSI1_DP3: IMX8_INPUT (U1.D26), Interconnect (J4.98)
CSI2_CKN: IMX8_INPUT (U1.B23), Interconnect (J6.16)
CSI2_CKP: IMX8_INPUT (U1.A23), Interconnect (J6.18)
CSI2_DN0: IMX8_INPUT (U1.B25), Interconnect (J6.28)
CSI2_DN1: IMX8_INPUT (U1.B24), Interconnect (J6.22)
CSI2_DN2: IMX8_INPUT (U1.B22), Interconnect (J6.10)
CSI2_DN3: IMX8_INPUT (U1.B21), Interconnect (J6.4)
CSI2_DP0: IMX8_INPUT (U1.A25), Interconnect (J6.30)
CSI2_DP1: IMX8_INPUT (U1.A24), Interconnect (J6.24)
CSI2_DP2: IMX8_INPUT (U1.A22), Interconnect (J6.12)
CSI2_DP3: IMX8_INPUT (U1.A21), Interconnect (J6.6)
DSI_CKN: IMX8_DISPLAY (U1.B18), Interconnect (J4.83)
DSI_CKP: IMX8_DISPLAY (U1.A18), Interconnect (J4.85)
DSI_DN0: IMX8_DISPLAY (U1.B16), Interconnect (J4.71)
DSI_DN1: IMX8_DISPLAY (U1.B17), Interconnect (J4.77)
DSI_DN2: IMX8_DISPLAY (U1.B19), Interconnect (J4.89)
DSI_DN3: IMX8_DISPLAY (U1.B20), Interconnect (J4.95)
DSI_DP0: IMX8_DISPLAY (U1.A16), Interconnect (J4.73)
DSI_DP1: IMX8_DISPLAY (U1.A17), Interconnect (J4.79)
DSI_DP2: IMX8_DISPLAY (U1.A19), Interconnect (J4.91)
DSI_DP3: IMX8_DISPLAY (U1.A20), Interconnect (J4.97)
EARC_N_HPD: IMX8_DISPLAY (U1.AH22), Interconnect (J3.59)
EARC_P_UTIL: IMX8_DISPLAY (U1.AJ23), Interconnect (J3.61)
ECSPI1_MISO: IMX8_IO (U1.AD20), Interconnect (J5.77)
ECSPI1_MOSI: IMX8_IO (U1.AC20), Interconnect (J5.75)
ECSPI2_MISO: IMX8_IO (U1.AH20), Interconnect (J3.31)
ECSPI2_MOSI: IMX8_IO (U1.AJ21), Interconnect (J3.33)
ECSPI2_SCLK: IMX8_IO (U1.AH21), Interconnect (J3.53)
ECSPI2_SS0: IMX8_IO (U1.AJ22), Interconnect (J3.55)
ENET2_MDC: IMX8_PHY (U1.AH28), Interconnect (J3.99)
ENET2_MDIO: IMX8_PHY (U1.AH29), Interconnect (J3.100)
ENET2_RD0: IMX8_PHY (U1.AG29), Interconnect (J3.82)
ENET2_RD1: IMX8_PHY (U1.AG28), Interconnect (J3.84)
ENET2_RD2: IMX8_PHY (U1.AF29), Interconnect (J3.86)
ENET2_RD3: IMX8_PHY (U1.AF28), Interconnect (J3.88)
ENET2_RX_CTL: IMX8_PHY (U1.AE28), Interconnect (J3.72)
ENET2_RXC: IMX8_PHY (U1.AE29), Interconnect (J3.74)
ENET2_TD0: IMX8_PHY (U1.AC25), Interconnect (J5.85)
ENET2_TD1: IMX8_PHY (U1.AE26), Interconnect (J3.37)
ENET2_TD2: IMX8_PHY (U1.AF26), Interconnect (J3.66)
ENET2_TD3: IMX8_PHY (U1.AD24), Interconnect (J3.68)
ENET2_TX_CTL: IMX8_PHY (U1.AF24), Interconnect (J5.98)
ENET2_TXC: IMX8_PHY (U1.AE24), Interconnect (J5.93)
GPIO1_IO00: IMX8_IO (U1.A7), Interconnect (J4.21)
GPIO1_IO01: IMX8_IO (U1.E8), Interconnect (J4.23)
GPIO1_IO05: IMX8_IO (U1.B4), Interconnect (J4.19)
GPIO1_IO06: IMX8_IO (U1.A3), Interconnect (J4.25)
GPIO1_IO07: IMX8_IO (U1.F6), Interconnect (J4.32)
GPIO1_IO08: IMX8_IO (U1.A8), Interconnect (J4.30)
GPIO1_IO09: IMX8_IO (U1.B8), Interconnect (J4.28)
GPIO1_IO10: IMX8_IO (U1.B7), Interconnect (J4.26)
GPIO1_IO11: IMX8_IO (U1.D8), Interconnect (J4.22)
GPIO1_IO12: IMX8_IO (U1.A5), Interconnect (J4.11)
GPIO1_IO13: IMX8_IO (U1.A6), Interconnect (J4.18)
GPIO1_IO14: IMX8_IO (U1.A4), Interconnect (J4.15)
GPIO1_IO15: IMX8_IO (U1.B5), Interconnect (J4.13)
HDMI_CEC: IMX8_DISPLAY (U1.AD22), Interconnect (J3.49)
HDMI_DDC_SCL: IMX8_DISPLAY (U1.AC22), Interconnect (J3.41)
HDMI_DDC_SDA: IMX8_DISPLAY (U1.AF22), Interconnect (J3.43)
HDMI_HPD: IMX8_DISPLAY (U1.AE22), Interconnect (J3.47)
HDMI_TX0_N: IMX8_DISPLAY (U1.AJ25), Interconnect (J3.71)
HDMI_TX0_P: IMX8_DISPLAY (U1.AH25), Interconnect (J3.73)
HDMI_TX1_N: IMX8_DISPLAY (U1.AJ26), Interconnect (J3.77)
HDMI_TX1_P: IMX8_DISPLAY (U1.AH26), Interconnect (J3.79)
HDMI_TX2_N: IMX8_DISPLAY (U1.AJ27), Interconnect (J3.83)
HDMI_TX2_P: IMX8_DISPLAY (U1.AH27), Interconnect (J3.85)
HDMI_TXC_N: IMX8_DISPLAY (U1.AJ24), Interconnect (J3.65)
HDMI_TXC_P: IMX8_DISPLAY (U1.AH24), Interconnect (J3.67)
I2C1_SCL: IMX8_INTERFACE (R34.1), IMX8_IO (U1.AC8), IMX8_PMIC (U5.41), Interconnect (J6.46)
I2C1_SDA: IMX8_INTERFACE (R33.1), IMX8_IO (U1.AH7), IMX8_PMIC (U5.42), Interconnect (J3.28)
I2C2_SCL: IMX8_INTERFACE (R36.1), IMX8_IO (U1.AH6), Interconnect (J3.24)
I2C2_SDA: IMX8_INTERFACE (R35.1), IMX8_IO (U1.AE8), Interconnect (J5.57)
I2C3_SCL: IMX8_INTERFACE (R38.1), IMX8_IO (U1.AJ7), Interconnect (J3.26)
I2C3_SDA: IMX8_INTERFACE (R37.1), IMX8_IO (U1.AJ6), Interconnect (J3.22)
I2C4_SCL: IMX8_INTERFACE (R40.1), IMX8_IO (U1.AF8), Interconnect (J5.65)
I2C4_SDA: IMX8_INTERFACE (R39.1), IMX8_IO (U1.AD8), Interconnect (J5.67)
I2C5_SCL: IMX8_INTERFACE (R42.1), IMX8_PHY (U1.AE18), Interconnect (J5.88)
I2C5_SDA: IMX8_INTERFACE (R41.1), IMX8_PHY (U1.AC18), Interconnect (J5.76)
I2C6_SCL: IMX8_INTERFACE (R43.1), IMX8_PHY (U1.AC14), Interconnect (J3.2)
I2C6_SDA: IMX8_INTERFACE (R44.1), IMX8_PHY (U1.AD14), Interconnect (J3.4)
JTAG_TCK: IMX8_IO (R5.1 U1.G18), Interconnect (J4.68)
JTAG_TDI: IMX8_IO (U1.G16), Interconnect (J4.64)
JTAG_TDO: IMX8_IO (U1.F14), Interconnect (J4.62)
JTAG_TMS: IMX8_IO (U1.G14), Interconnect (J4.60)
LVDS0_CLK_N: IMX8_DISPLAY (U1.G28), Interconnect (J6.47)
LVDS0_CLK_P: IMX8_DISPLAY (U1.F29), Interconnect (J6.45)
LVDS0_TX0_N: IMX8_DISPLAY (U1.E28), Interconnect (J6.35)
LVDS0_TX0_P: IMX8_DISPLAY (U1.D29), Interconnect (J6.33)
LVDS0_TX1_N: IMX8_DISPLAY (U1.F28), Interconnect (J6.41)
LVDS0_TX1_P: IMX8_DISPLAY (U1.E29), Interconnect (J6.39)
LVDS0_TX2_N: IMX8_DISPLAY (U1.H28), Interconnect (J6.53)
LVDS0_TX2_P: IMX8_DISPLAY (U1.G29), Interconnect (J6.51)
LVDS0_TX3_N: IMX8_DISPLAY (U1.J28), Interconnect (J6.59)
LVDS0_TX3_P: IMX8_DISPLAY (U1.H29), Interconnect (J6.57)
LVDS1_CLK_N: IMX8_DISPLAY (U1.B28), Interconnect (J6.17)
LVDS1_CLK_P: IMX8_DISPLAY (U1.A28), Interconnect (J6.15)
LVDS1_TX0_N: IMX8_DISPLAY (U1.B26), Interconnect (J6.5)
LVDS1_TX0_P: IMX8_DISPLAY (U1.A26), Interconnect (J6.3)
LVDS1_TX1_N: IMX8_DISPLAY (U1.B27), Interconnect (J6.11)
LVDS1_TX1_P: IMX8_DISPLAY (U1.A27), Interconnect (J6.9)
LVDS1_TX2_N: IMX8_DISPLAY (U1.C28), Interconnect (J6.23)
LVDS1_TX2_P: IMX8_DISPLAY (U1.B29), Interconnect (J6.21)
LVDS1_TX3_N: IMX8_DISPLAY (U1.D28), Interconnect (J6.29)
LVDS1_TX3_P: IMX8_DISPLAY (U1.C29), Interconnect (J6.27)
ONOFF: IMX8_IO (R3.2 U1.G22), Interconnect (J6.74)
PCIE_CLK_N: IMX8_PHY (U1.E16), Interconnect (J4.53)
PCIE_CLK_P: IMX8_PHY (U1.D16), Interconnect (J4.55)
PCIE_RX_N: IMX8_PHY (U1.B14), Interconnect (J4.59)
PCIE_RX_P: IMX8_PHY (U1.A14), Interconnect (J4.61)
PCIE_TX_N: IMX8_PHY (U1.B15), Interconnect (J4.65)
PCIE_TX_P: IMX8_PHY (U1.A15), Interconnect (J4.67)
PMIC_32K_OUT: IMX8_PMIC (U5.7), Interconnect (J5.41)
PMIC_nINT: IMX8_IO (U1.D6), IMX8_PMIC (U5.13)
PMIC_ON_REQ: IMX8_IO (R1.2 U1.F22), IMX8_PMIC (U5.39), Interconnect (J6.78)
PMIC_SCLH: IMX8_PMIC (U5.25), Interconnect (J5.51)
PMIC_SCLL: IMX8_PMIC (U5.27), Interconnect (J5.45)
PMIC_SDAH: IMX8_PMIC (U5.24), Interconnect (J5.53)
PMIC_SDAL: IMX8_PMIC (U5.26), Interconnect (J5.47)
PMIC_STBY_REQ: IMX8_IO (U1.J24), IMX8_PMIC (U5.40)
POR_B: IMX8_IO (R2.2 U1.J29), IMX8_PMIC (U5.9), Interconnect (J6.76)
SAI1_MCLK: IMX8_PHY (U1.AE12), Interconnect (J5.97)
SAI1_RXC: IMX8_PHY (U1.AH8), Interconnect (J3.34)
SAI1_RXD0: IMX8_PHY (U1.AC10), Interconnect (J5.82)
SAI1_RXD1: IMX8_PHY (U1.AF10), Interconnect (J5.84)
SAI1_RXD2: IMX8_PHY (U1.AH9), Interconnect (J3.38)
SAI1_RXD3: IMX8_PHY (U1.AJ8), Interconnect (J3.32)
SAI1_RXD4: IMX8_PHY (U1.AD10), Interconnect (J5.92)
SAI1_RXD5: IMX8_PHY (U1.AE10), Interconnect (J5.94)
SAI1_RXD6: IMX8_PHY (U1.AH10), Interconnect (J3.44)
SAI1_RXD7: IMX8_PHY (U1.AH12), Interconnect (J3.56)
SAI1_RXFS: IMX8_PHY (U1.AJ9), Interconnect (J3.36)
SAI1_TXC: IMX8_PHY (U1.AJ12), Interconnect (J3.52)
SAI1_TXD0: IMX8_PHY (U1.AJ11), Interconnect (J3.46)
SAI1_TXD1: IMX8_PHY (U1.AJ10), Interconnect (J3.42)
SAI1_TXD2: IMX8_PHY (U1.AH11), Interconnect (J3.48)
SAI1_TXD3: IMX8_PHY (U1.AD12), Interconnect (J5.83)
SAI1_TXD4: IMX8_PHY (U1.AH13), Interconnect (J3.62)
SAI1_TXD5: IMX8_PHY (U1.AH14), Interconnect (J3.1)
SAI1_TXD6: IMX8_PHY (U1.AC12), Interconnect (J5.91)
SAI1_TXD7: IMX8_PHY (U1.AJ13), Interconnect (J3.58)
SAI1_TXFS: IMX8_PHY (U1.AF12), Interconnect (J5.95)
SAI2_MCLK: IMX8_PHY (U1.AJ15), Interconnect (J3.3)
SAI2_RXC: IMX8_PHY (U1.AJ16), Interconnect (J3.7)
SAI2_RXD: IMX8_PHY (U1.AJ14), Interconnect (J3.64)
SAI2_RXFS: IMX8_PHY (U1.AH17), Interconnect (J3.15)
SAI2_TXC: IMX8_PHY (U1.AH15), Interconnect (J3.5)
SAI2_TXD: IMX8_PHY (U1.AH16), Interconnect (J3.11)
SAI2_TXFS: IMX8_PHY (U1.AJ17), Interconnect (J3.13)
SAI3_MCLK: IMX8_PHY (U1.AJ20), Interconnect (J3.27)
SAI3_RXC: IMX8_PHY (U1.AJ18), Interconnect (J3.17)
SAI3_RXD: IMX8_PHY (U1.AF18), Interconnect (J5.55)
SAI3_RXFS: IMX8_PHY (U1.AJ19), Interconnect (J3.23)
SAI3_TXC: IMX8_PHY (U1.AH19), Interconnect (J3.25)
SAI3_TXD: IMX8_PHY (U1.AH18), Interconnect (J3.21)
SAI3_TXFS: IMX8_PHY (U1.AC16), Interconnect (J5.61)
SAI5_MCLK: IMX8_PHY (U1.AF14), Interconnect (J5.58)
SAI5_RXD0: IMX8_PHY (U1.AE16), Interconnect (J6.52)
SAI5_RXD1: IMX8_PHY (U1.AD16), Interconnect (J5.66)
SAI5_RXD2: IMX8_PHY (U1.AF16), Interconnect (J5.62)
SAI5_RXD3: IMX8_PHY (U1.AE14), Interconnect (J5.68)
SD1_CLK: IMX8_eMMC (U1.W28), Interconnect (J6.75)
SD1_CMD: IMX8_eMMC (U1.W29), Interconnect (J6.77)
SD1_DATA0: IMX8_eMMC (U1.Y29), Interconnect (J6.81)
SD1_DATA1: IMX8_eMMC (U1.Y28), Interconnect (J6.83)
SD1_DATA2: IMX8_eMMC (U1.V29), Interconnect (J6.85)
SD1_DATA3: IMX8_eMMC (U1.V28), Interconnect (J6.87)
SD1_DATA4: IMX8_eMMC (U1.U26), Interconnect (J6.91)
SD1_DATA5: IMX8_eMMC (U1.AA29), Interconnect (J6.93)
SD1_DATA6: IMX8_eMMC (U1.AA28), Interconnect (J6.95)
SD1_DATA7: IMX8_eMMC (U1.U25), Interconnect (J6.97)
SD1_RESET_B: IMX8_eMMC (U1.W25), Interconnect (J6.73)
SD1_STROBE: IMX8_eMMC (U1.W26), Interconnect (J6.71)
SD2_CLK: IMX8_eMMC (U1.AB29), Interconnect (J3.96)
SD2_CMD: IMX8_eMMC (U1.AB28), Interconnect (J3.98)
SD2_DATA0: IMX8_eMMC (U1.AC28), Interconnect (J3.91)
SD2_DATA1: IMX8_eMMC (U1.AC29), Interconnect (J3.93)
SD2_DATA2: IMX8_eMMC (U1.AA26), Interconnect (J3.95)
SD2_DATA3: IMX8_eMMC (U1.AA25), Interconnect (J3.97)
SD2_nCD: IMX8_eMMC (U1.AD29), Interconnect (J3.94)
SD2_RESET_B: IMX8_eMMC (U1.AD28), IMX8_PMIC (U5.12), Interconnect (J3.35)
SD2_VSEL: IMX8_IO (U1.E6), IMX8_PMIC (U5.29)
SD2_WP: IMX8_eMMC (U1.AC26), Interconnect (J3.92)
SPDIF_RX: IMX8_PHY (U1.AD18), Interconnect (J5.78)
SYS_nRST: IMX8_PMIC (R30.2 U5.8), Interconnect (J5.43)
UART1_RXD: IMX8_IO (U1.AD6), Interconnect (J5.54)
UART1_TXD: IMX8_IO (U1.AJ3), Interconnect (J3.6)
UART2_RXD: IMX8_IO (U1.AF6), Interconnect (J5.64)
UART2_TXD: IMX8_IO (U1.AH4), Interconnect (J3.12)
UART3_RXD: IMX8_IO (U1.AE6), Interconnect (J5.56)
UART3_TXD: IMX8_IO (U1.AJ4), Interconnect (J3.8)
UART4_RXD: IMX8_IO (U1.AJ5), Interconnect (J3.14)
UART4_TXD: IMX8_IO (U1.AH5), Interconnect (J3.18)
USB1_D_N: IMX8_PHY (U1.E10), Interconnect (J4.36)
USB1_D_P: IMX8_PHY (U1.D10), Interconnect (J4.38)
USB1_RX_N: IMX8_PHY (U1.B9), Interconnect (J4.29)
USB1_RX_P: IMX8_PHY (U1.A9), Interconnect (J4.31)
USB1_TX_N: IMX8_PHY (C143.2), Interconnect (J4.35)
USB1_TX_P: IMX8_PHY (C83.1), Interconnect (J4.37)
USB1_VBUS_3V3: IMX8_PHY (U1.A11), Interconnect (J4.44)
USB2_D_N: IMX8_PHY (U1.E14), Interconnect (J4.54)
USB2_D_P: IMX8_PHY (U1.D14), Interconnect (J4.56)
USB2_RX_N: IMX8_PHY (U1.B12), Interconnect (J4.41)
USB2_RX_P: IMX8_PHY (U1.A12), Interconnect (J4.43)
USB2_TX_N: IMX8_PHY (C84.2), Interconnect (J4.47)
USB2_TX_P: IMX8_PHY (C85.2), Interconnect (J4.49)
USB2_VBUS_3V3: IMX8_PHY (U1.D12), Interconnect (J4.50)
WDOG_B: IMX8_IO (U1.B6), IMX8_PMIC (PTP34.1 R31.2 U5.28)